# EAGLE schematic avoccado-avr-pcb-yolandi-panel (EAGLE 7.2.0)
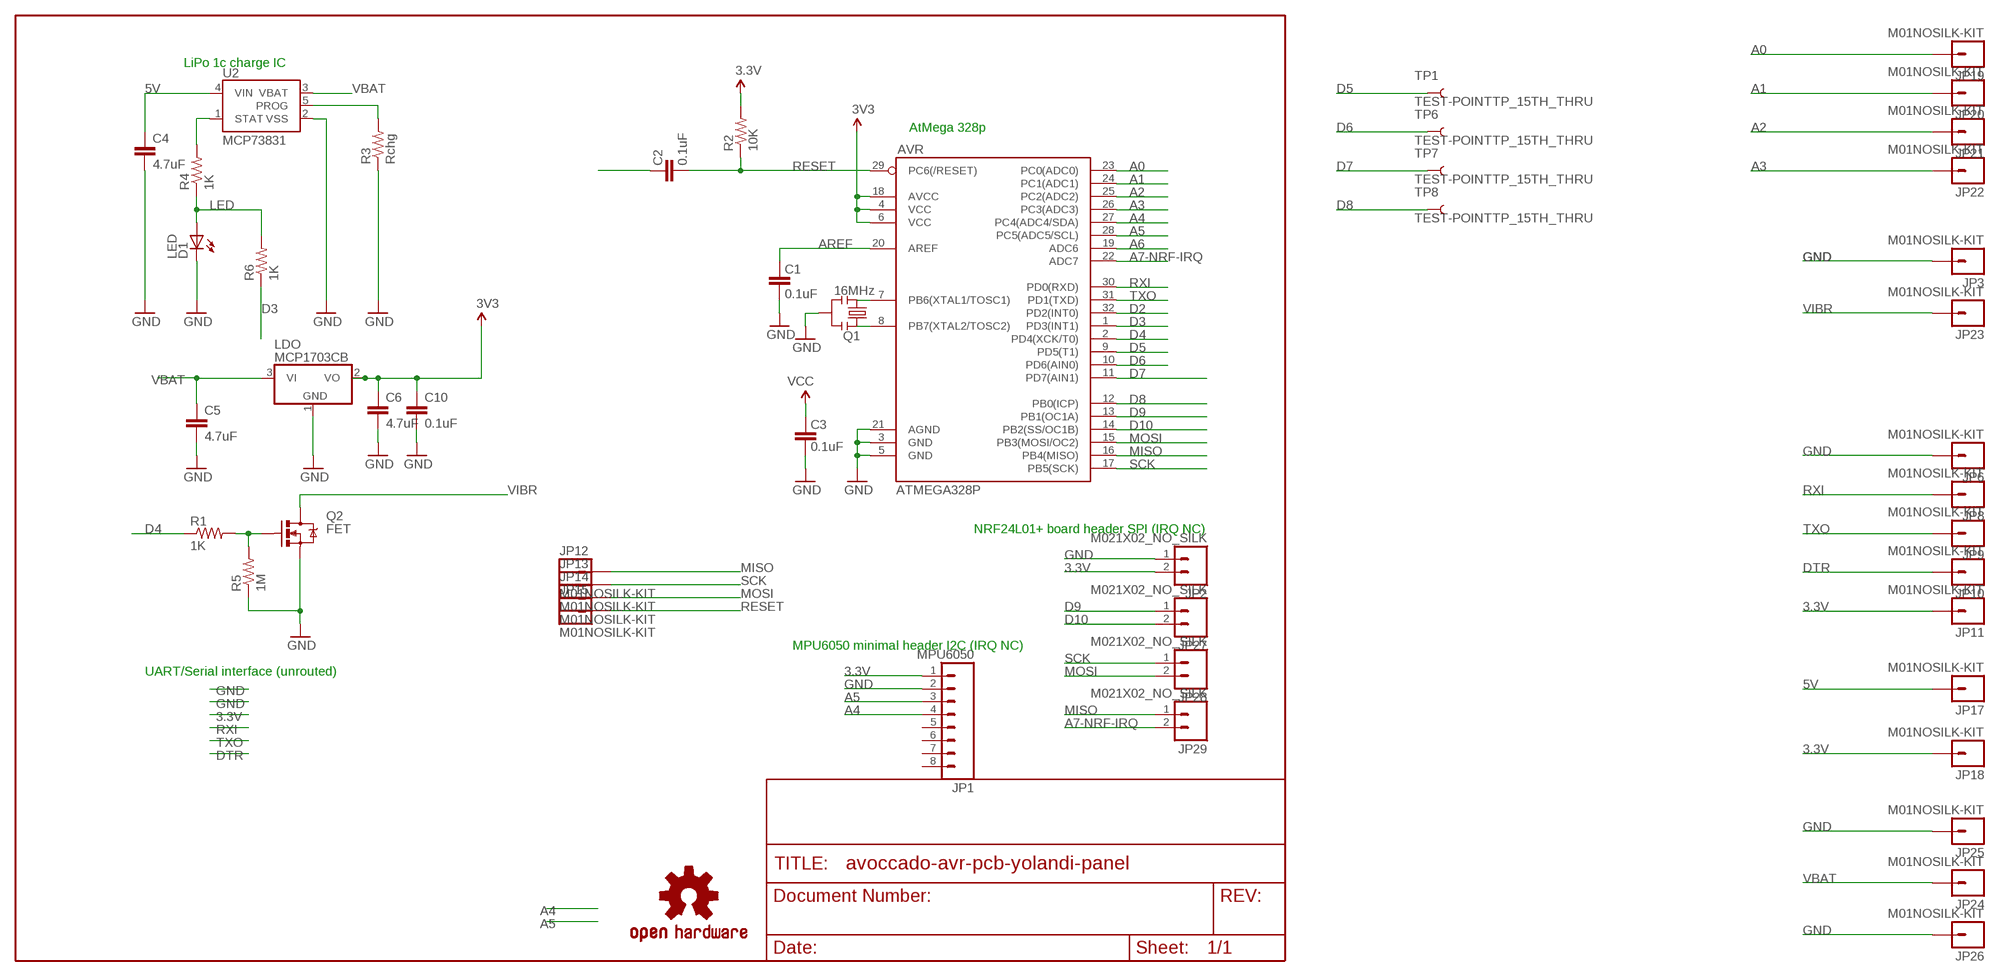
[diagram p0: schematic, sheet 1]

## Parts
AVR  ATMEGA328P  ATMEGA328_SMT  [TQFP32-08]
C1  0.1uF  CAP0402  [C0402]
C2  0.1uF  CAP0402  [C0402]
C3  0.1uF  CAP0402  [C0402]
C4  4.7uF  4.7UF-6.3V-10%(0603)0603  [0603-CAP]
C5  4.7uF  4.7UF-6.3V-10%(0603)0603  [0603-CAP]
C6  4.7uF  4.7UF-6.3V-10%(0603)0603  [0603-CAP]
C10  0.1uF  CAP0402  [C0402]
D1  LED  LED0603  [LED-0603]
JP1  MPU6050  M08NO_SILK  [1X08_PIN1_NO_SILK]
JP2  M021X02_NO_SILK  [1X02_NO_SILK]
JP3  M01NOSILK-KIT  [1X01NS-KIT]
JP6  M01NOSILK-KIT  [1X01NS-KIT]
JP8  M01NOSILK-KIT  [1X01NS-KIT]
JP9  M01NOSILK-KIT  [1X01NS-KIT]
JP10  M01NOSILK-KIT  [1X01NS-KIT]
JP11  M01NOSILK-KIT  [1X01NS-KIT]
JP12  M01NOSILK-KIT  [1X01NS-KIT]
JP13  M01NOSILK-KIT  [1X01NS-KIT]
JP14  M01NOSILK-KIT  [1X01NS-KIT]
JP15  M01NOSILK-KIT  [1X01NS-KIT]
JP17  M01NOSILK-KIT  [1X01NS-KIT]
JP18  M01NOSILK-KIT  [1X01NS-KIT]
JP19  M01NOSILK-KIT  [1X01NS-KIT]
JP20  M01NOSILK-KIT  [1X01NS-KIT]
JP21  M01NOSILK-KIT  [1X01NS-KIT]
JP22  M01NOSILK-KIT  [1X01NS-KIT]
JP23  M01NOSILK-KIT  [1X01NS-KIT]
JP24  M01NOSILK-KIT  [1X01NS-KIT]
JP25  M01NOSILK-KIT  [1X01NS-KIT]
JP26  M01NOSILK-KIT  [1X01NS-KIT]
JP27  M021X02_NO_SILK  [1X02_NO_SILK]
JP28  M021X02_NO_SILK  [1X02_NO_SILK]
JP29  M021X02_NO_SILK  [1X02_NO_SILK]
LDO  MCP1703CB  [SOT23]
LOGO1  OSHW-LOGOS  [OSHW-LOGO-S]
Q1  16MHz  RESONATORSMD  [RESONATOR-SMD]
Q2  FET  MOSFET-NCHANNEL2N7002PW  [SOT323]
R1  1K  RESISTOR0603  [0603-RES]
R2  10K  RESISTOR0603  [0603-RES]
R3  Rchg  RESISTOR0603  [0603-RES]
R4  1K  RESISTOR0603  [0603-RES]
R5  1M  RESISTOR0603  [0603-RES]
R6  1K  RESISTOR0603  [0603-RES]
TP1  TEST-POINTTP_15TH_THRU  [TP_15TH]
TP6  TEST-POINTTP_15TH_THRU  [TP_15TH]
TP7  TEST-POINTTP_15TH_THRU  [TP_15TH]
TP8  TEST-POINTTP_15TH_THRU  [TP_15TH]
U2  MCP73831  [SOT23-5]

## Nets
3.3V: AVR.4(VCC) AVR.6(VCC) AVR.18(AVCC) C3.2 C6.1 C10.1 JP1.1 JP2.2 JP11.1 JP18.1 LDO.2(VO) R2.2 ; supply symbol labelled VCC, 3V3
5V: C4.1 JP17.1 U2.4(VIN)
A0: AVR.23(PC0(ADC0)) JP19.1
A1: AVR.24(PC1(ADC1)) JP20.1
A2: AVR.25(PC2(ADC2)) JP21.1
A3: AVR.26(PC3(ADC3)) JP22.1
A4: AVR.27(PC4(ADC4/SDA)) JP1.4
A5: AVR.28(PC5(ADC5/SCL)) JP1.3
A6: AVR.19(ADC6)
A7-NRF-IRQ: AVR.22(ADC7) JP29.2
AREF: AVR.20(AREF) C1.2
CHG-PROG: R3.2 U2.5(PROG)
D2: AVR.32(PD2(INT0))
D3: AVR.1(PD3(INT1)) R6.1
D4: AVR.2(PD4(XCK/T0)) R1.1
D5: AVR.9(PD5(T1)) TP1.P$1
D6: AVR.10(PD6(AIN0)) TP6.P$1
D7: AVR.11(PD7(AIN1)) TP7.P$1
D8: AVR.12(PB0(ICP)) TP8.P$1
D9: AVR.13(PB1(OC1A)) JP27.1
D10: AVR.14(PB2(SS/OC1B)) JP27.2
DTR: C2.2 JP10.1
GND [vcc]: AVR.3(GND) AVR.5(GND) AVR.21(AGND) C1.1 C3.1 C4.2 C5.2 C6.2 C10.2 D1.C JP1.2 JP2.1 JP3.1 JP6.1 JP25.1 JP26.1 LDO.1(GND) Q1.2 Q2.2(S) R3.1 R5.1 U2.2(VSS)
LED: D1.A R4.1 R6.2
MISO: AVR.16(PB4(MISO)) JP12.1 JP29.1
MOSI: AVR.15(PB3(MOSI/OC2)) JP14.1 JP28.2
N$1: AVR.8(PB7(XTAL2/TOSC2)) Q1.1
N$2: AVR.7(PB6(XTAL1/TOSC1)) Q1.3
N$6: Q2.1(G) R1.2 R5.2
RESET: AVR.29(PC6(/RESET)) C2.1 JP15.1 R2.1
RXI: AVR.30(PD0(RXD)) JP8.1
SCK: AVR.17(PB5(SCK)) JP13.1 JP28.1
SOC: R4.2 U2.1(STAT)
TXO: AVR.31(PD1(TXD)) JP9.1
VBAT [vcc]: C5.1 JP24.1 LDO.3(VI) U2.3(VBAT)
VIBR: JP23.1 Q2.3(D)
Unconnected: JP1.5 JP1.6 JP1.7 JP1.8

## Notes on the sheet
- LiPo 1c charge IC
- AtMega 328p
- NRF24L01+ board header SPI (IRQ NC)
- MPU6050 minimal header I2C (IRQ NC)
- UART/Serial interface (unrouted)

## Library data of the parts
AVR = SparkFun-DigitalIC:ATMEGA328_SMT: 32-Pin Atmega328 part Commonly used on Arduino compatible boards Available in QFP and QFN packages TQFP is IC-09069 QFN is non-stock; PROD_ID: IC-09069
C1-C3 C10 = SparkFun:CAP: Capacitor Standard 0603 ceramic capacitor, and 0.1" leaded capacitor.
C4-C6 = SparkFun-Capacitors:4.7UF-6.3V-10%(0603): CAP-08280; PROD_ID: CAP-08280
D1 = SparkFun:LED: LEDs Standard schematic elements and footprints for 5mm, 3mm, 1206, and 0603 sized LEDs. 5mm - Spark Fun Electronics SKU : COM-00529 (and others)
JP1 = SparkFun-Connectors:M08: Header 8 Standard 8-pin 0.1" header. Use with straight break away headers (SKU : PRT-00116), right angle break away headers (PRT-00553), swiss pins (PRT-00743), machine pins (PRT-00117), and female headers (PRT-00115).
JP2 JP27-JP29 = SparkFun-Connectors:M02: Standard 2-pin 0.1" header. Use with - straight break away headers ( PRT-00116) - right angle break away headers (PRT-00553) - swiss pins (PRT-00743) - machine pins (PRT-00117) - female headers (PRT-00115) Molex polarized connector foot print use with: PRT-08233 with associated crimp pins and housings. 2.54_SCREWTERM for use with PRT-10571. 3.5mm Screw Terminal footprints for PRT-08084 5mm Screw Terminal footprints for use with PRT-08432
JP3 JP6 JP8-JP15 JP17-JP26 = SparkFun-Connectors:M01: Header 1 Standard 1-pin 0.1" header. Use with straight break away headers (SKU : PRT-00116), right angle break away headers (PRT-00553), swiss pins (PRT-00743), machine pins (PRT-00117), and female headers (PRT-00115).
LDO = linear:MCP1703: 250 mA, 16V, Low Quiescent Current LDO Regulator Source: http://ww1.microchip.com/downloads/en/DeviceDoc/22049b.pdf
LOGO1 = SparkFun-Aesthetics:OSHW-LOGO: Open Source Hardware Logo This logo indicates the piece of hardware it is found on incorporates a OSHW license and/or adheres to the definition of open source hardware found here: http://freedomdefined.org/OSHW
Q1 = SparkFun:RESONATOR: Resonator Small SMD resonator. This is the itty bitty 10/20MHz resonators with built in caps. CSTCE10M0G55 and CSTCE20M0V53. Footprint has been reviewed closely but hasn't been tested yet.
Q2 = SparkFun-DiscreteSemi:MOSFET-NCHANNEL: Common NMOSFET Parts MFG P/N Store ID Prod ID FDD8780 TRANS-09984 SI7820DN TRANS-11055 FDS6630A IC-08089 2N7002PW TRANS-11151 FQP30N06L COM-10213 TRANS-10060 BSS123LT1G TRANS-08345 BSS138 TRANS-00830 BS170 2N7000; PROD_ID: TRANS-11151
R1-R6 = SparkFun-Resistors:RESISTOR: Resistor Basic schematic elements and footprints for 0603, 1206, and PTH resistors.
TP1 TP6-TP8 = SparkFun-Passives:TEST-POINT: Bare copper test points for troubleshooting or ICT
U2 = SparkFun:MCP73831: Microchip's MCP73831 Miniature single cell, fully integrated Li-Ion, Li-polymer charge management controller http://ww1.microchip.com/downloads/en/DeviceDoc/21984a.pdf

## Net classes
1 vcc: width 0.254 mm
3 usbvcc: width 0.203 mm, drill 0.61 mm, clearance 0.152 mm